# EAGLE design sensorboard_mag_rev0 (EAGLE 6.5.0)
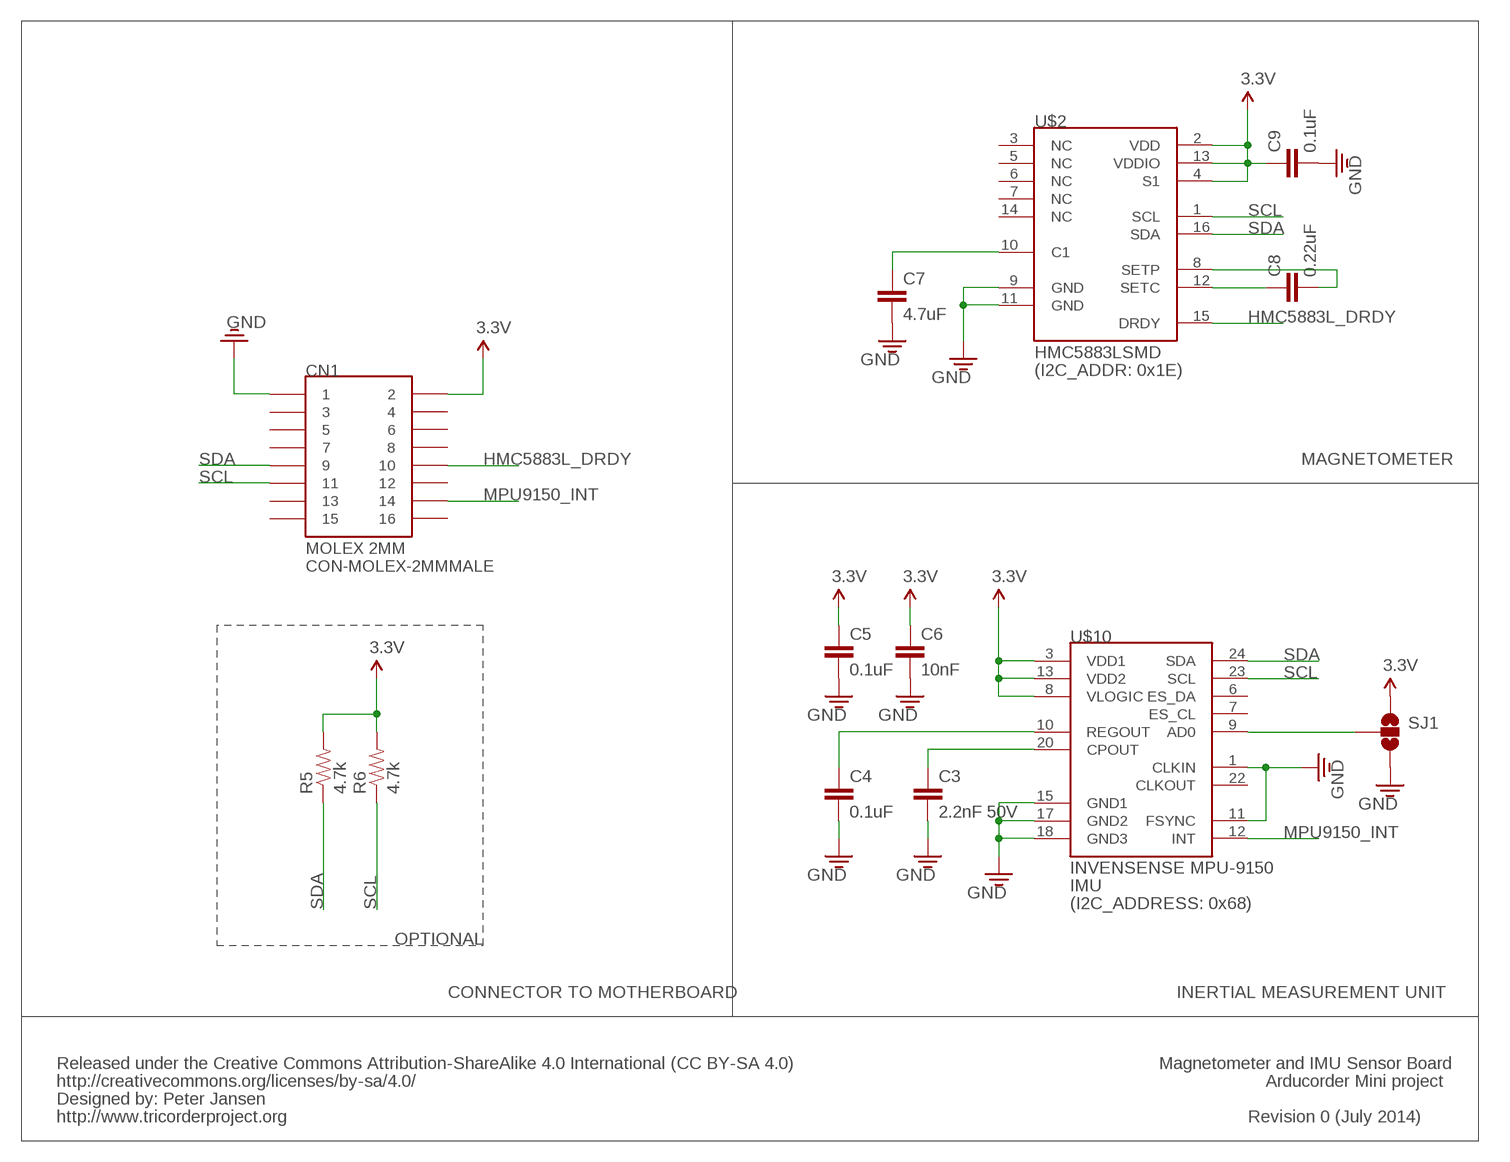
[diagram p0: schematic, sheet 1]

## Parts
C3  2.2nF 50V  CAP0603  [0603]
C4  0.1uF  CAP0603  [0603]
C5  0.1uF  CAP0603  [0603]
C6  10nF  CAP0603  [0603]
C7  4.7uF  CAP0603  [0603]
C8  0.22uF  CAP0603  [0603]
C9  0.1uF  CAP0603  [0603]
CN1  CON-MOLEX-2MMMALE  [MOLEX-0877591650]
R5  4.7k  RESISTOR0603  [0603]
R6  4.7k  RESISTOR0603  [0603]
SJ1  SOLDERJUMPER_2WAYPASTE2&3  [SJ_3_PASTE2&3]
U$2  HMC5883LSMD  [16LPCC]
U$10  MPU-9150  [LGA-24-(4X4MM)]

## Nets
3.3V: C5.1 C6.1 C9.1 CN1.2 R5.2 R6.2 SJ1.1 U$2.2(VDD) U$2.4(S1) U$2.13(VDDIO) U$10.3(VDD1) U$10.8(VLOGIC) U$10.13(VDD2)
GND: C3.2 C4.2 C5.2 C6.2 C7.2 C9.2 CN1.1 SJ1.3 U$2.9(GND) U$2.11(GND) U$10.1(CLKIN) U$10.11(FSYNC) U$10.15(GND1) U$10.17(GND2) U$10.18(GND3)
HMC5883L_DRDY: CN1.10 U$2.15(DRDY)
MPU9150_INT: CN1.14 U$10.12(INT)
N$1: SJ1.2 U$10.9(AD0)
N$6: C7.1 U$2.10(C1)
N$7: C3.1 U$10.20(CPOUT)
N$8: C4.1 U$10.10(REGOUT)
N$9: C8.1 U$2.12(SETC)
N$10: C8.2 U$2.8(SETP)
SCL: CN1.11 R6.1 U$2.1(SCL) U$10.23(SCL)
SDA: CN1.9 R5.1 U$2.16(SDA) U$10.24(SDA)
Unconnected: CN1.3 CN1.4 CN1.5 CN1.6 CN1.7 CN1.8 CN1.12 CN1.13 CN1.15 CN1.16 U$2.3(NC) U$2.5(NC) U$2.6(NC) U$2.7(NC) U$2.14(NC) U$10.6(ES_DA) U$10.7(ES_CL) U$10.22(CLKOUT)

## Notes on the sheet
- (I2C_ADDR: 0x1E)
- MAGNETOMETER
- (I2C_ADDRESS: 0x68)
- OPTIONAL
- CONNECTOR TO MOTHERBOARD | INERTIAL MEASUREMENT UNIT
- Released under the Creative Commons Attribution-ShareAlike 4.0 International (CC BY-SA 4.0) | Magnetometer and IMU Sensor Board
- http://creativecommons.org/licenses/by-sa/4.0/ | Arducorder Mini project
- Designed by: Peter Jansen
- http://www.tricorderproject.org | Revision 0 (July 2014)

## Library data of the parts
C3-C9 = notes_mark5:CAP: Capacitor Standard 0603 ceramic capacitor, and 0.1" leaded capacitor.
CN1 = notes-arducorder-mini:CON-MOLEX-2MM: Molex 2mm pitch connectors. (87368-1624, 0877591650)
R5 R6 = notes_mark5a:RESISTOR: Resistor Basic schematic elements and footprints for 0603, 1206, and PTH 1/10th watt (small) resistors.
SJ1 = SparkFun-Passives:SOLDERJUMPER_2WAY: Solder Jumper 2 way solder jumper
U$2 = SparkFun-Sensors:HMC5883L: 3 Axis Digital Compass IC
U$10 = notes_mark5:MPU-9150: Invensense MPU-9150 9-Axis Inertial Measurement Unit (Accelerometer, Gyroscope, and Magnetometer) with Digital I2C Interface

## Net classes
1 supply: width 0.178 mm
3 usbvcc: width 0.61 mm, drill 0.508 mm, clearance 0.203 mm to class 0, clearance 0.254 mm
5 USB: width 0.14 mm

## Board
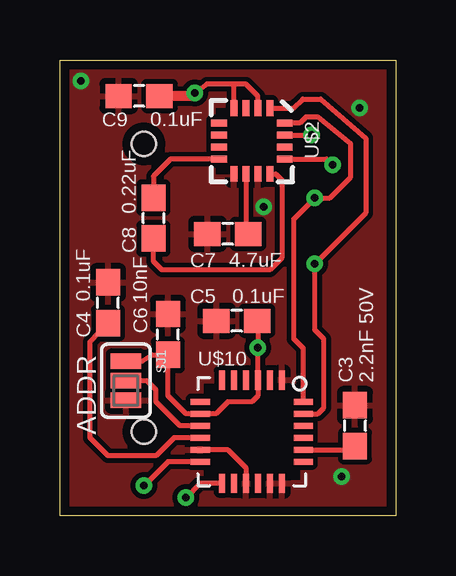
[diagram p1: board, top side]
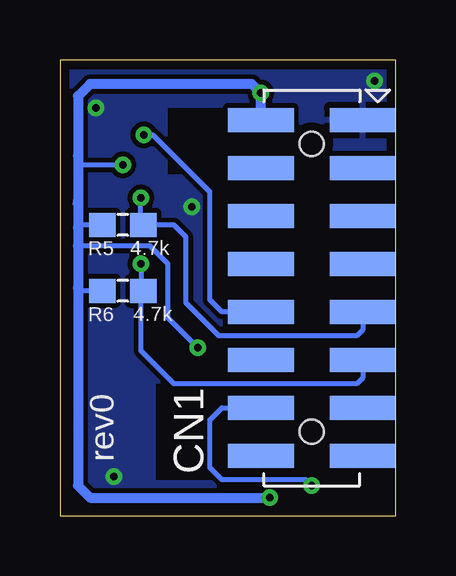
[diagram p2: board, bottom side, seen from below]

Size 14 x 19 mm. Coordinates in mm from the lower left corner, seen from the top.
Outline: 0,19 14,19 14,0 0,0 0,19
Copper layers (1*16): Top 0.0356mm / dielectric 1.5011mm / Bottom 0.0356mm
Design rules "default *": minimum track width 8mil, minimum drill 13mil, track to track 8mil, track to pad 8mil, pad to pad 8mil, via to via 8mil, smd to smd 8mil, copper to edge 15mil, drill to drill 20mil, minimum pad ring 7mil, minimum via ring 7mil, stop-mask expansion 3mil, vias tented up to drill 0mil, thermal gap 10mil
tRestrict: area 6.5,14.2 to 9.5,17; area 6,1.5 to 10,5.5
bRestrict: area 6.5,14.2 to 9.5,17; area 6,1.5 to 10,5.5
vRestrict: area 2.5,1.5 to 4.5,17.5

### Footprints (pad centres in the part's own frame; a part is rotated, then mirrored left to right if it is on the bottom)
0603 = smd 1.1 x 1: 1 -0.85,0; 2 0.85,0
MOLEX-0877591650 = smd 1 x 2.75: 1 7,-2.125; 2 7,2.125; 3 5,-2.125; 4 5,2.125; 5 3,-2.125; 6 3,2.125; 7 1,-2.125; 8 1,2.125; 9 -1,-2.125; 10 -1,2.125; 11 -3,-2.125; 12 -3,2.125; 13 -5,-2.125; 14 -5,2.125; 15 -7,-2.125; 16 -7,2.125 | hole 1: -6,0; 6,0
SJ_3_PASTE2&3 = smd 0.635 x 1.27: 1 -0.813,0; 2 0,0; 3 0.813,0
16LPCC = smd 0.65 x 0.28: 1 -1.37,0.75; 2 -1.37,0.25; 3 -1.37,-0.25; 4 -1.37,-0.75; 9 1.37,-0.75; 10 1.37,-0.25; 11 1.37,0.25; 12 1.37,0.75 | smd 0.28 x 0.65: 5 -0.75,-1.37; 6 -0.25,-1.37; 7 0.25,-1.37; 8 0.75,-1.37; 13 0.75,1.37; 14 0.25,1.37; 15 -0.25,1.37; 16 -0.75,1.37
LGA-24-(4X4MM) = smd 0.8 x 0.25: 1 -2.15,1.25; 2 -2.15,0.75; 3 -2.15,0.25; 4 -2.15,-0.25; 5 -2.15,-0.75; 6 -2.15,-1.25; 13 2.15,-1.25; 14 2.15,-0.75; 15 2.15,-0.25; 16 2.15,0.25; 17 2.15,0.75; 18 2.15,1.25 | smd 0.25 x 0.8: 7 -1.25,-2.15; 8 -0.75,-2.15; 9 -0.25,-2.15; 10 0.25,-2.15; 11 0.75,-2.15; 12 1.25,-2.15; 19 1.25,2.15; 20 0.75,2.15; 21 0.25,2.15; 22 -0.25,2.15; 23 -0.75,2.15; 24 -1.25,2.15

### Placement (x,y rotation side)
C3  12.31,3.75 90 top
C4  2,8.88 90 top
C5  7.38,8.12 180 top
C6  4.5,7.55 90 top
C7  7,11.75 180 top
C8  3.91,12.41 90 top
C9  3.3,17.5 180 top
CN1  3.5,9.5 90 bottom
R5  11.38,12.12 180 bottom
R6  11.38,9.38 180 bottom
SJ1  2.75,5.62 270 top
U$2  8.01,15.62 270 top
U$10  8,3.5 270 top

### Tracks (layer width: path | path; a pad name or v marks a point on that pad's centre or on a via)
3.3V  (via drill 0.33)
  Top 0.203: U$10.13 5.85,1.35 v5.25,0.75 | U$2.2 8.26,17.49 7.75,18 7.25,18 | 7.25,18 6.12,18 v5.62,17.62 | U$2.4 7.26,17.99 7.25,18 | U$2.13 11.12,14.87 v11.38,14.62 | C5.1 8.25,8.1 v8.25,7 U$10.3 8.25,5 8,4.75 7,4.75 6.5,4.25 U$10.8 5.25,4.25 4.5,5 C6.1 3.83,6.7 3.44,6.44 SJ1.1
  Top 0.406: v5.62,17.62 5.5,17.5 C9.1
  Bottom 0.203: 13.38,13 13.25,13.12 | R6.2 13.12,9.38 13.25,9.5 | R5.2 13.12,12.12 13.25,12 | v11.38,14.62 13.12,14.62 13.25,15 | v8.25,7 9.5,8.25 9.5,10.5 10.25,11.25 13.25,11.25
  Bottom 0.406: CN1.2 v5.62,17.62 6,18 12.75,18 13.25,17.5 13.25,15 13.25,13.12 13.25,12 13.25,11.25 13.25,9.5 13.25,1.25 12.75,0.75 v5.25,0.75
GND  (via drill 0.33)
  Top 0.203: U$10.11 7,2.75 7.75,2 U$10.15
  other vias: 0.88,18.12 11.75,1.62 8.5,12.88 12.5,17
  pour Top: 0,19 0,0 14,0 14,19
  pour Bottom: 0,19 0,0 14,0 14,19
HMC5883L_DRDY  (via drill 0.33)
  Top 0.203: U$2.15 10.24,15.87 v10.5,15.88
  Bottom 0.203: CN1.10 7.25,8.5 7.75,9 7.75,13.5 10.12,15.88 v10.5,15.88
MPU9150_INT  (via drill 0.33)
  Top 0.203: U$10.12 4.5,2.25 v3.5,1.25
  Bottom 0.203: v3.5,1.25 3.75,1.5 7.25,1.5 7.75,2 7.75,4 7.25,4.5 CN1.14
N$1
  Top 0.203: U$10.9 5,3.75 4,4.75 4,5.25 3.62,5.62 SJ1.2
N$6
  Top 0.203: U$2.10 7.76,11.84 C7.1
N$7
  Top 0.203: U$10.20 12.16,2.75 C3.1
N$8
  Top 0.203: U$10.10 4.75,3.25 4,2.5 2,2.5 1.25,3.25 1.25,7.25 C4.1
N$9
  Top 0.203: U$2.12 9,14.25 9.25,14 9.25,10.75 8.75,10.25 4.25,10.25 3.91,10.59 C8.1
N$10
  Top 0.203: U$2.8 4.62,14.87 3.91,14.16 C8.2
SCL  (via drill 0.33)
  Top 0.203: U$2.1 9.74,16.99 10.12,17.38 10.88,17.38 12.75,15.75 12.75,12.62 v10.62,10.5 10.62,7.75 11,7.38 11,4.5 10.75,4.25 U$10.23
  Bottom 0.203: CN1.11 1.38,5.75 1.62,5.5 9.25,5.5 10.62,6.88 10.62,9.35 R6.1 10.62,9.4 v10.62,10.5
SDA  (via drill 0.33)
  Top 0.203: U$2.16 10,16.38 10.25,16.62 10.75,16.62 12.12,15.5 12.12,14.12 11.25,13.25 v10.62,13.25 9.75,12.38 9.75,7.38 10.15,6.98 U$10.24
  Bottom 0.203: CN1.9 1.38,7.75 1.62,7.5 7.38,7.5 8.75,8.88 8.75,11.62 9.25,12.12 R5.1 | 10.62,12.1 R5.1 | R5.1 10.52,12.27 10.62,12.38 10.65,13.23 v10.62,13.25

### Text on the board
tPlace: ADDR
bPlace: rev0